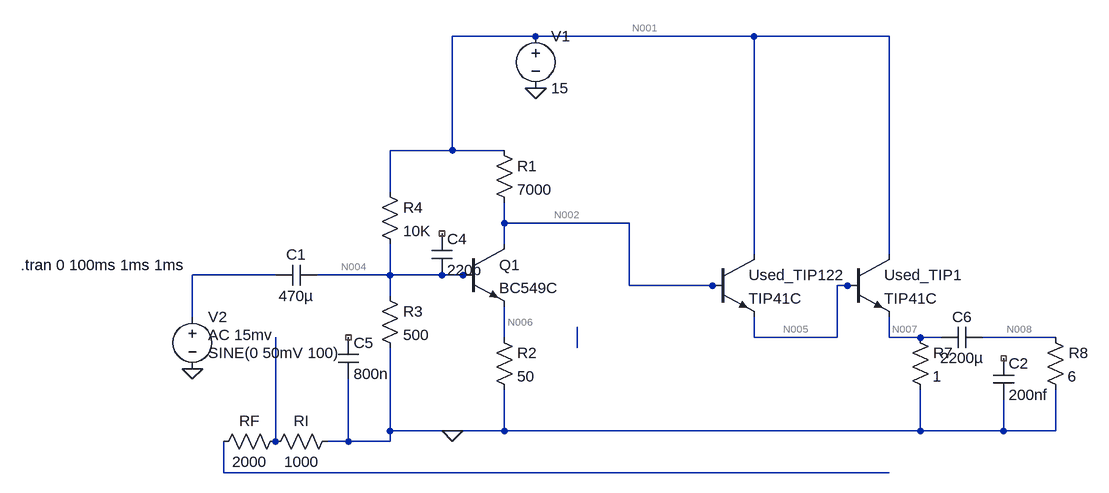
[diagram p0: schematic No bypass cap class A.asc]
No bypass cap class A.asc, the LTspice schematic file:
Version 4
SHEET 1 1128 680
WIRE 272 -256 144 -256
WIRE 608 -256 272 -256
WIRE 816 -256 608 -256
WIRE 144 -80 144 -256
WIRE 144 -80 48 -80
WIRE 224 -80 144 -80
WIRE 48 -16 48 -80
WIRE 224 32 224 0
WIRE 416 32 224 32
WIRE 224 64 224 32
WIRE 608 80 608 -256
WIRE 816 80 816 -256
WIRE -128 112 -256 112
WIRE 48 112 48 64
WIRE 48 112 -64 112
WIRE 128 112 48 112
WIRE 160 112 128 112
WIRE 176 112 160 112
WIRE 416 128 416 32
WIRE 544 128 416 128
WIRE 560 128 544 128
WIRE 752 128 736 128
WIRE 768 128 752 128
WIRE 48 144 48 112
WIRE -256 176 -256 112
WIRE 224 208 224 160
WIRE 608 208 608 176
WIRE 736 208 736 128
WIRE 736 208 608 208
WIRE 816 208 816 176
WIRE 864 208 816 208
WIRE 896 208 864 208
WIRE 1072 208 960 208
WIRE 336 224 336 192
WIRE 48 352 48 224
WIRE 144 352 48 352
WIRE 224 352 224 288
WIRE 224 352 144 352
WIRE 864 352 864 288
WIRE 864 352 224 352
WIRE 992 352 992 304
WIRE 992 352 864 352
WIRE 1072 352 1072 288
WIRE 1072 352 992 352
WIRE -128 368 -128 208
WIRE -16 368 -16 272
WIRE -16 368 -48 368
WIRE 48 368 48 352
WIRE 48 368 -16 368
WIRE -208 416 -208 368
WIRE 816 416 -208 416
FLAG 272 -176 0
FLAG 144 352 0
FLAG -256 256 0
SYMBOL npn 160 64 R0
SYMATTR InstName Q1
SYMATTR Value BC549C
SYMBOL res 208 -96 R0
SYMATTR InstName R1
SYMATTR Value 7000
SYMBOL voltage 272 -272 R0
WINDOW 123 0 0 Left 2
WINDOW 39 0 0 Left 2
SYMATTR InstName V1
SYMATTR Value 15
SYMBOL res 32 -32 R0
SYMATTR InstName R4
SYMATTR Value 10K
SYMBOL res 32 128 R0
SYMATTR InstName R3
SYMATTR Value 500
SYMBOL res 208 192 R0
SYMATTR InstName R2
SYMATTR Value 50
SYMBOL cap -64 96 R90
WINDOW 0 0 32 VBottom 2
WINDOW 3 32 32 VTop 2
SYMATTR InstName C1
SYMATTR Value 470µ
SYMBOL voltage -256 160 R0
WINDOW 123 24 44 Left 2
WINDOW 39 0 0 Left 2
WINDOW 3 24 72 Left 2
SYMATTR Value2 AC 15mv
SYMATTR Value SINE(0 50mV 100)
SYMATTR InstName V2
SYMBOL npn 544 80 R0
SYMATTR InstName Used_TIP122
SYMATTR Value TIP41C
SYMBOL res 848 192 R0
WINDOW 3 35 76 Left 2
SYMATTR Value 1
SYMATTR InstName R7
SYMBOL res -112 352 R90
WINDOW 0 0 56 VBottom 2
WINDOW 3 32 56 VTop 2
SYMATTR InstName RF
SYMATTR Value 2000
SYMBOL res -32 352 R90
WINDOW 0 0 56 VBottom 2
WINDOW 3 32 56 VTop 2
SYMATTR InstName RI
SYMATTR Value 1000
SYMBOL cap 112 48 R0
SYMATTR InstName C4
SYMATTR Value 220p
SYMBOL cap -32 208 R0
SYMATTR InstName C5
SYMATTR Value 800n
SYMBOL npn 752 80 R0
SYMATTR InstName Used_TIP1
SYMATTR Value TIP41C
SYMBOL res 1056 192 R0
WINDOW 3 35 76 Left 2
SYMATTR Value 6
SYMATTR InstName R8
SYMBOL cap 960 192 R90
WINDOW 0 0 32 VBottom 2
WINDOW 3 32 32 VTop 2
SYMATTR InstName C6
SYMATTR Value 2200µ
SYMBOL cap 976 240 R0
SYMATTR InstName C2
SYMATTR Value 200nf
TEXT -520 96 Left 2 !.tran 0 100ms 1ms 1ms

The netlist it stands for:
* No bypass cap class A.asc
Q1 N002 N004 N006 0 BC549C
R1 N001 N002 7000
V1 N001 0 15
R4 N001 N004 10K
R3 N004 0 500
R2 N006 0 50
C1 N004 N003 470µ
V2 N003 0 SINE(0 50mV 100) AC 15mv
Q§Used_TIP122 N001 N002 N005 0 TIP41C
R7 N007 0 1
RF N010 N011 2000
RI 0 N010 1000
C4 NC_01 N004 220p
C5 NC_02 0 800n
Q§Used_TIP1 N001 N005 N007 0 TIP41C
R8 N008 0 6
C6 N008 N007 2200µ
C2 NC_03 0 200nf
.model NPN NPN
.model PNP PNP
.lib standard.bjt
.tran 0 100ms 1ms 1ms
.backanno
.end

* Results of the author's LTspice run, read from the files saved beside the schematic
* Operating Point, zero values left out:
*   V(n002) = 4.148 V
*   V(n004) = 713.4 mV
*   V(n006) = 51.67 mV
*   V(n001) = 15 V
*   V(n005) = 3.56 V
*   V(n007) = 2.625 V
*   Ic(Used_tip1) = 2.572 A
*   Ib(Used_tip1) = 53.03 mA
*   Ie(Used_tip1) = -2.625 A
*   Ic(Used_tip122) = 52.52 mA
*   Ib(Used_tip122) = 518.8 µA
*   Ie(Used_tip122) = -53.03 mA
*   Ic(Q1) = 1.031 mA
*   Ib(Q1) = 1.96 µA
*   Ie(Q1) = -1.033 mA
*   I(R7) = 2.625 A
*   I(R2) = 1.033 mA
*   I(R3) = 1.427 mA
*   I(R4) = 1.429 mA
*   I(R1) = 1.55 mA
*   I(V1) = -2.628 A
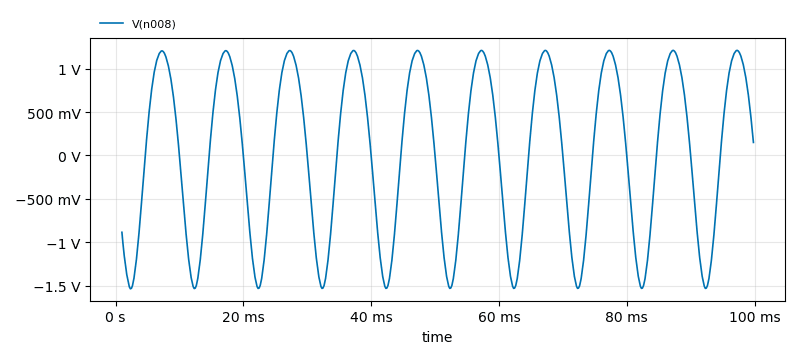
[diagram p1: Transient Analysis of No bypass cap class A.asc, plotted from the saved traces]
* Transient Analysis, 1 run:
*   V(n008): min -1.537 V, max 1.211 V, average 1.389 mV, rms 969.6 mV, last 150 mV